# Altium schematic sheet 02 BLOCK.SchDoc
size 420 x 297 mm
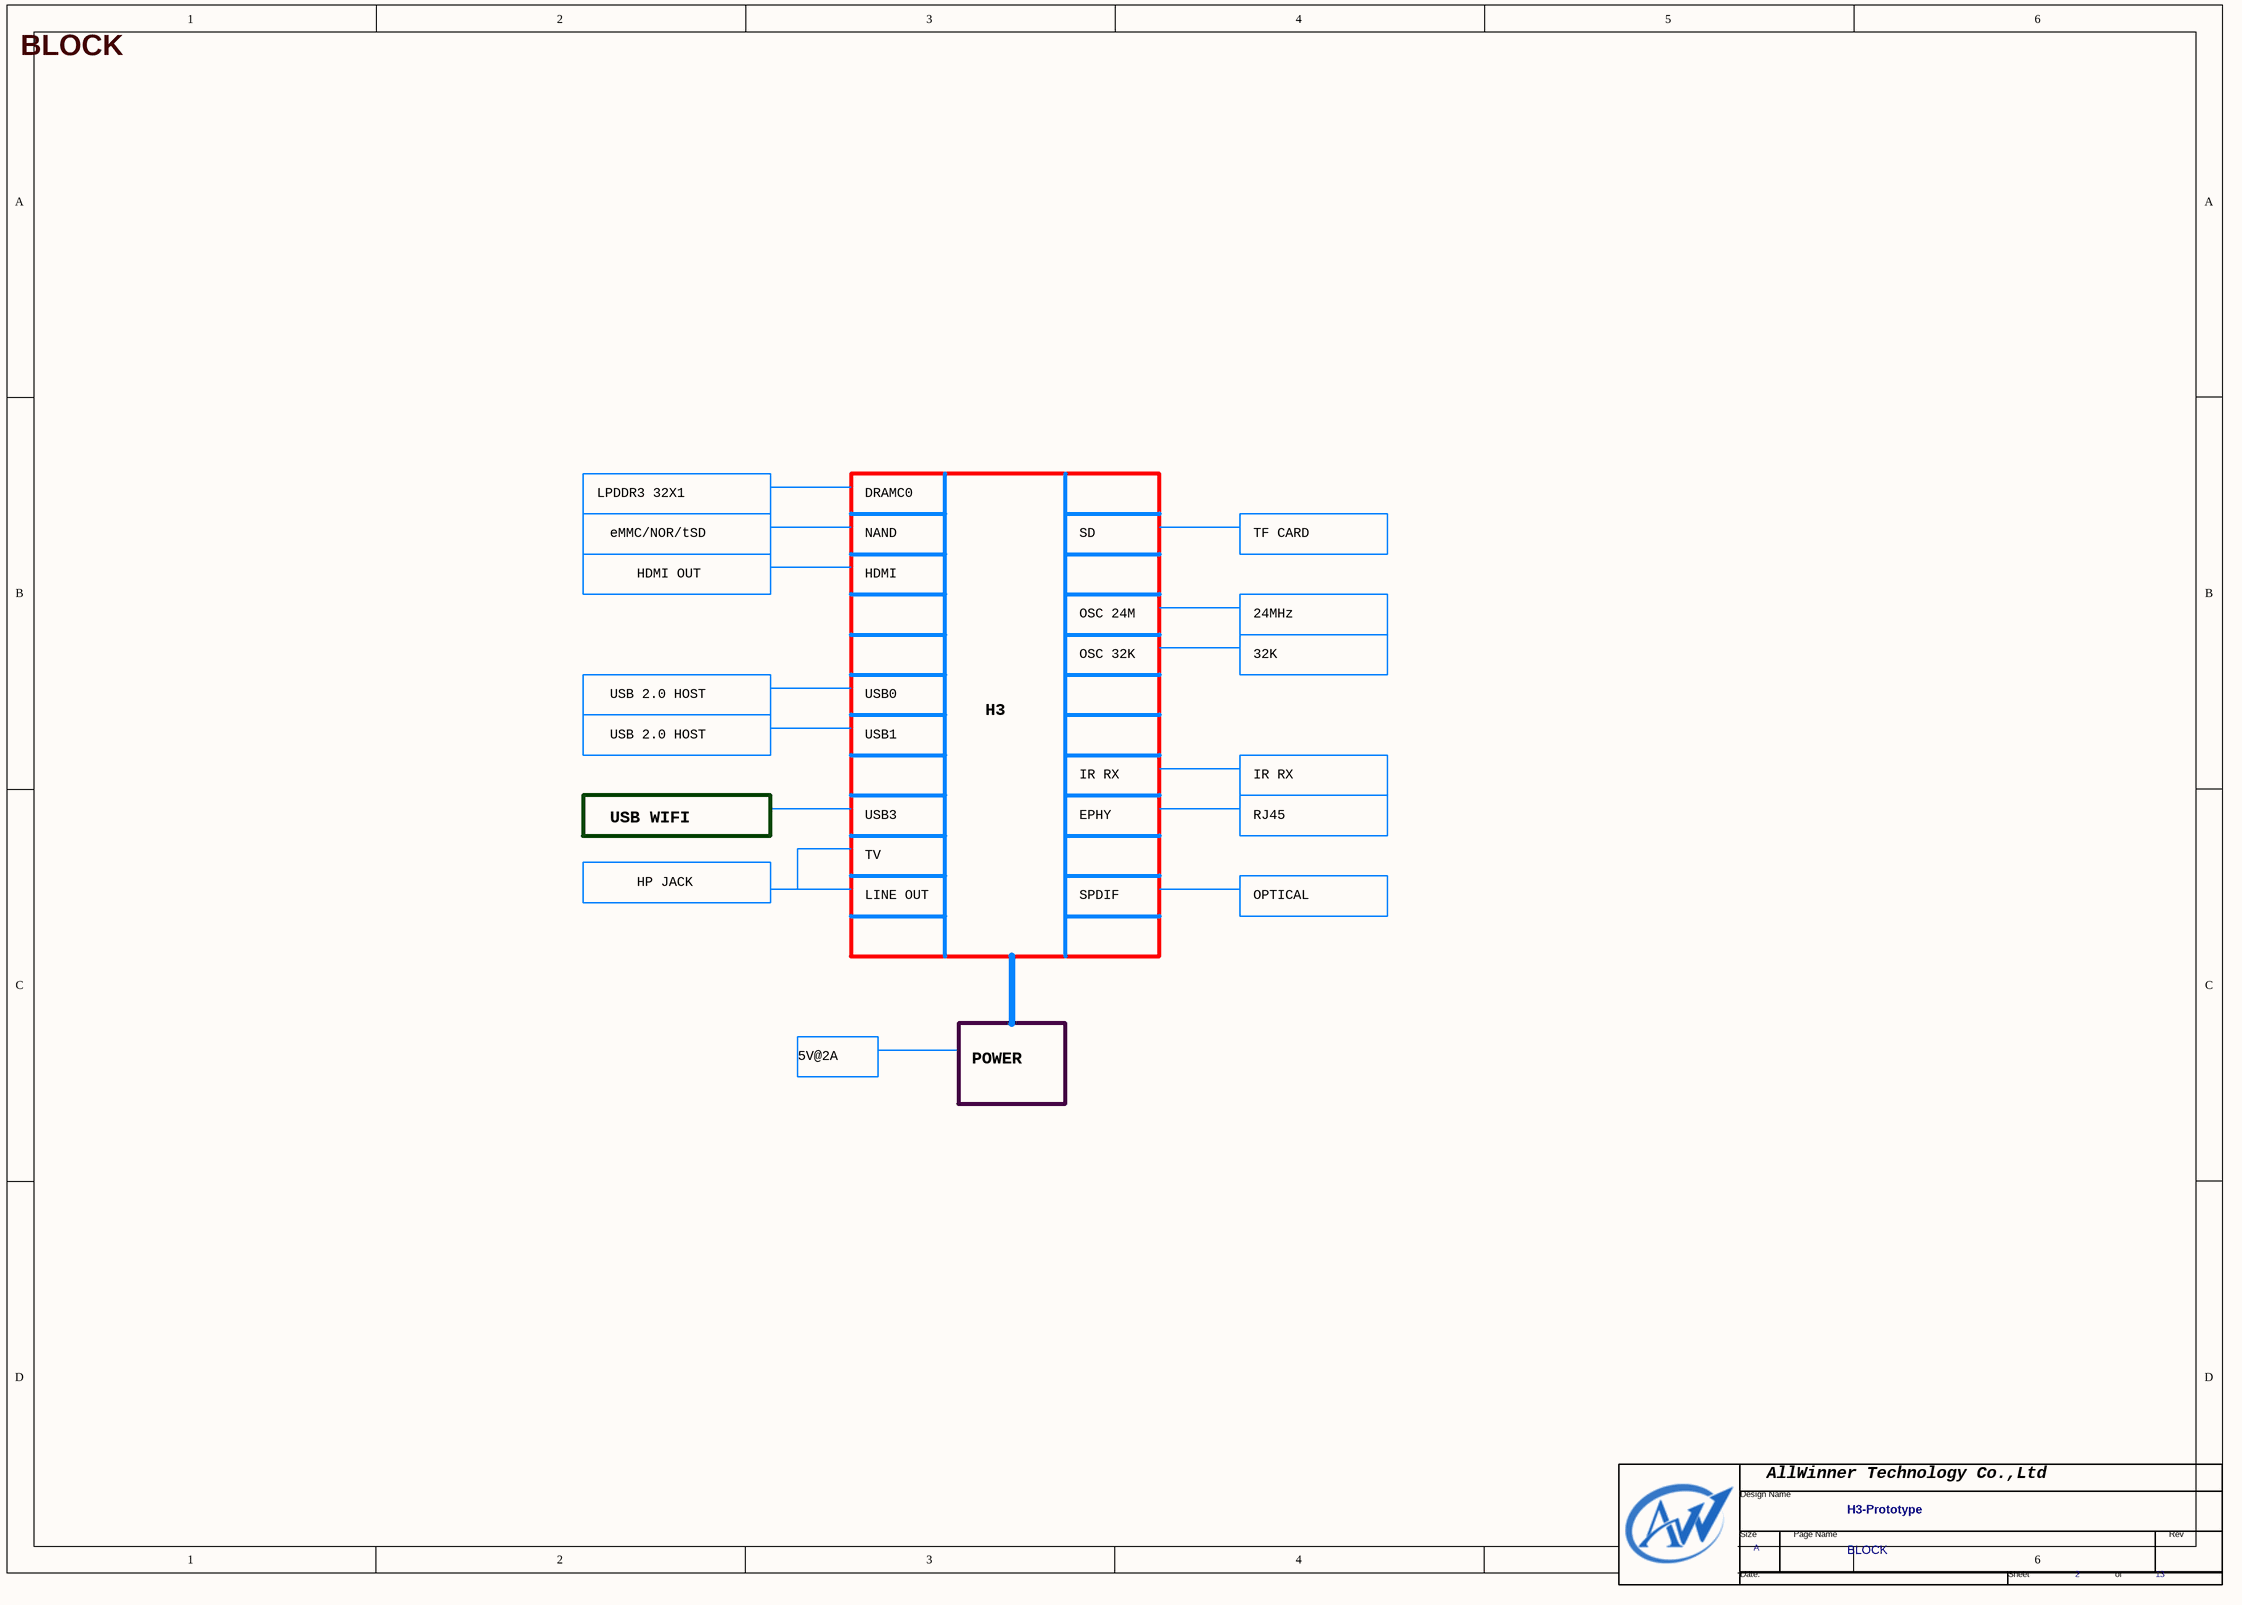
[diagram p0: 02 BLOCK.SchDoc]

## Parts
*  Page Count: 13  Page Number: 2  Page Size: A  Title: H3-Prototype  Doc: BLOCK  (hidden comment: TitleBlock0-AW)  (graphical)

## Notes on the sheet
- BLOCK
- LPDDR3 32X1
- DRAMC0
- eMMC/NOR/tSD
- HDMI OUT
- NAND
- HDMI
- SD
- TF CARD
- OSC 24M
- OSC 32K
- 24MHz
- 32K
- USB 2.0 HOST
- USB0
- H3
- USB1
- IR RX
- USB WIFI
- USB3
- TV
- EPHY
- RJ45
- HP JACK
- LINE OUT
- SPDIF
- OPTICAL
- 5V@2A
- POWER
- (in symbol TitleBlock0-AW) AllWinner Technology Co.,Ltd; Design Name; Size; Page Name; Rev; Date:; Sheet; of

## Library data of the parts
* = TitleBlock0-AW: Page Create Date: March  8, 1995